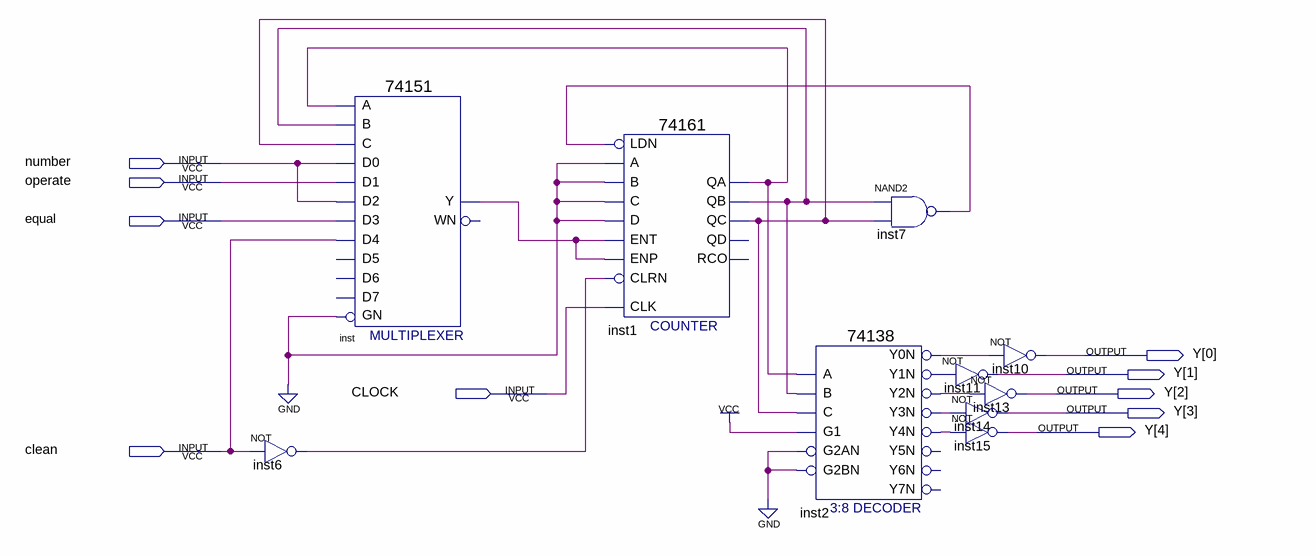
[diagram p0: schematic sheet]
// Quartus schematic zhuangtai.bdf as structural Verilog: 10 symbols, 10 pins
module zhuangtai (
  input  number,
  input  operate,
  input  equal,
  input  CLOCK,
  input  clean,
  output [4:0] Y
);

  wire inst1_qa, inst1_qb, inst1_qc, inst2_y0n, inst2_y1n, inst2_y2n, inst2_y3n, inst2_y4n, inst6_out,
       inst7_out, inst_y;

  not inst6 (inst6_out, clean);
  \74151  inst (
    .GN(1'b0), .C(inst1_qc), .B(inst1_qb), .A(inst1_qa), .D0(number), .D1(operate), .D4(clean), .D3(equal),
    .D2(number), .Y(inst_y));  // open: D5, D6, D7, WN
  \74161  inst1 (
    .CLRN(inst6_out), .CLK(CLOCK), .ENP(inst_y), .LDN(inst7_out), .A(1'b0), .D(1'b0), .ENT(inst_y), .B(1'b0),
    .C(1'b0), .QC(inst1_qc), .QB(inst1_qb), .QA(inst1_qa));  // open: QD, RCO
  \74138  inst2 (
    .A(inst1_qa), .B(inst1_qb), .G1(1'b1), .C(inst1_qc), .G2AN(1'b0), .G2BN(1'b0), .Y0N(inst2_y0n),
    .Y1N(inst2_y1n), .Y2N(inst2_y2n), .Y3N(inst2_y3n), .Y4N(inst2_y4n));  // open: Y5N, Y6N, Y7N
  nand inst7 (inst7_out, inst1_qb, inst1_qc);
  not inst10 (Y[0], inst2_y0n);
  not inst11 (Y[1], inst2_y1n);
  not inst13 (Y[2], inst2_y2n);
  not inst14 (Y[3], inst2_y3n);
  not inst15 (Y[4], inst2_y4n);
endmodule
